# Altium schematic sheet Vesc_Simple_2.SchDoc
size C
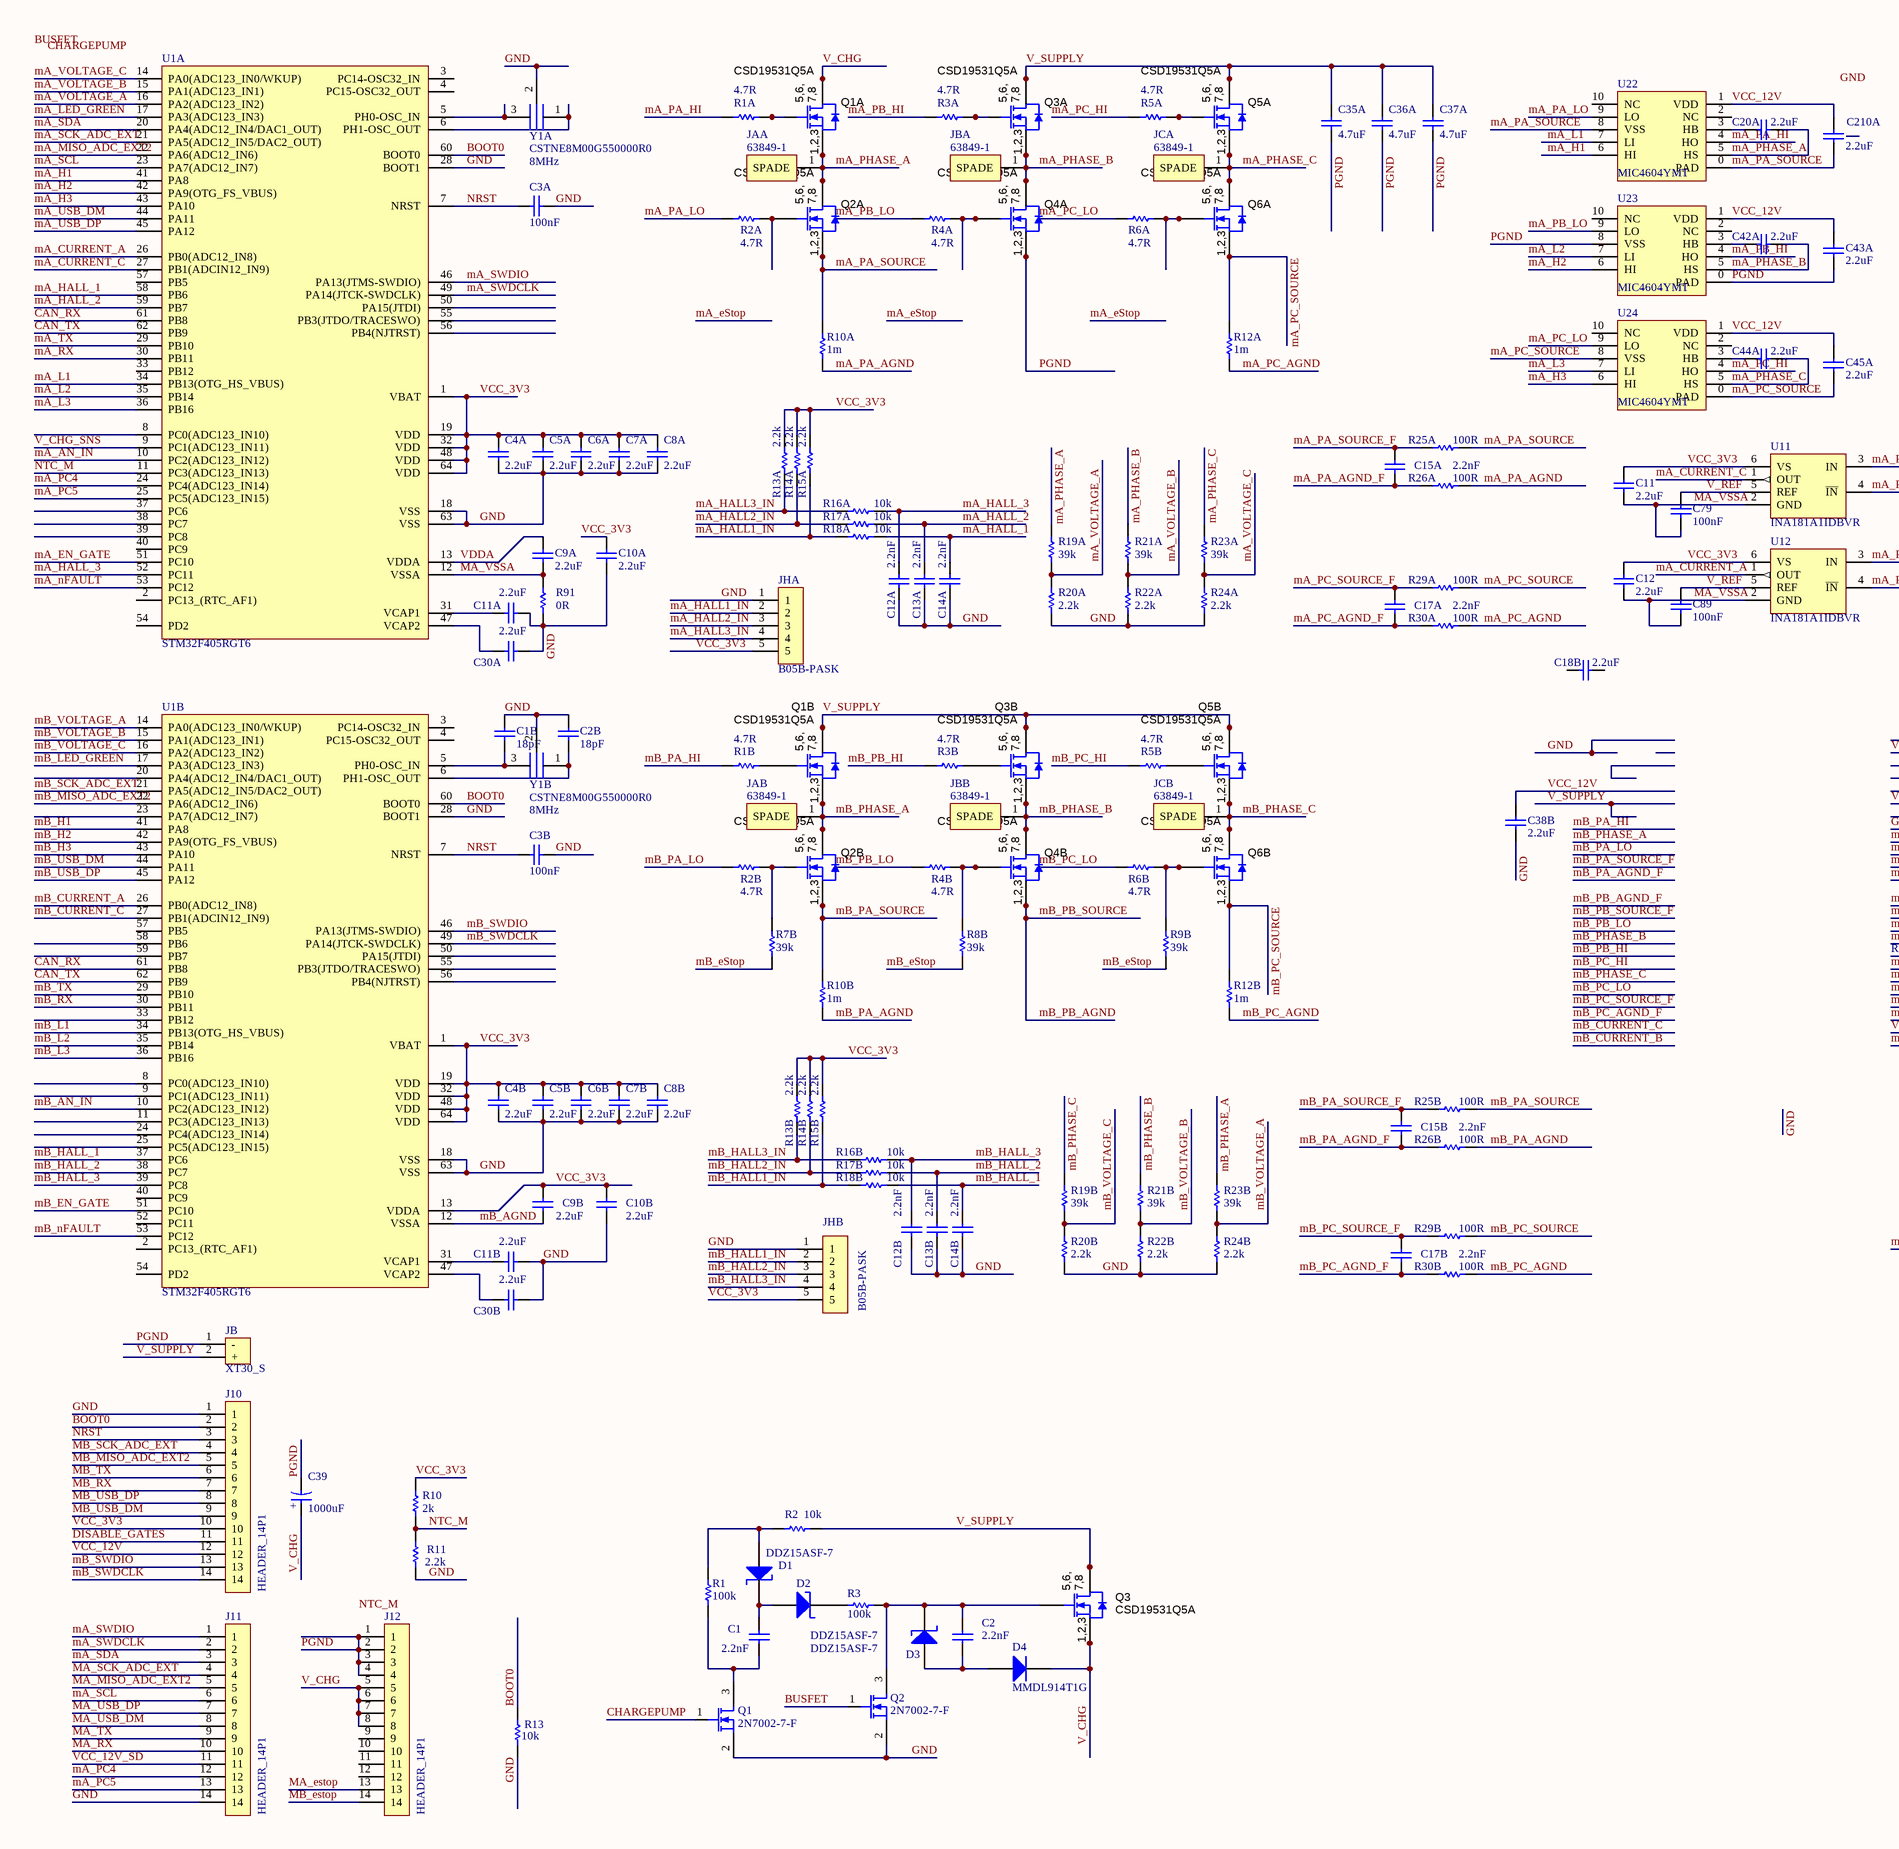
[diagram p0: Vesc_Simple_2.SchDoc, left]
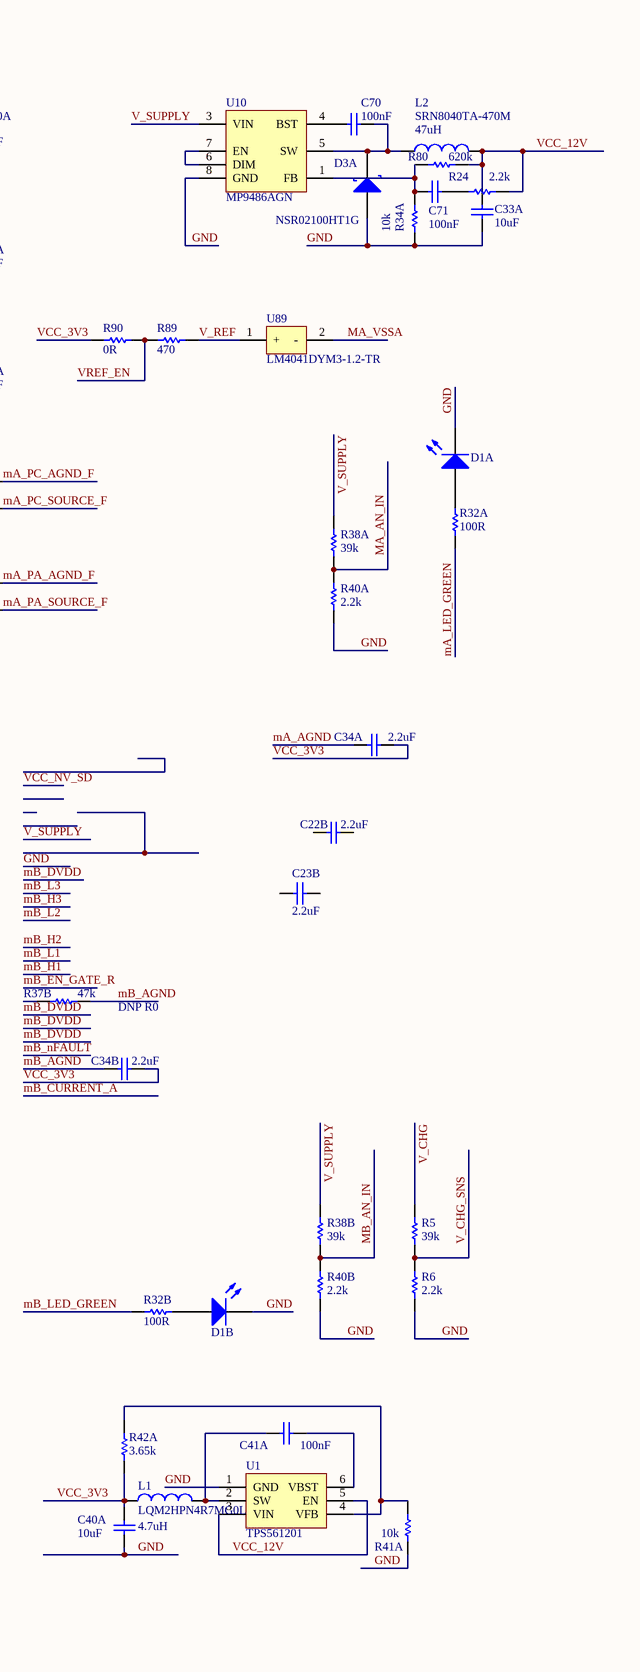
[diagram p1: Vesc_Simple_2.SchDoc, right]

## Parts
C1  value 2.2nF  [CAP 0402]  (hidden comment: GCM155R72A222KA37D)
C1B  value 18pF  [CAP 0402]  (hidden comment: GCM1555C1H180JA16D)
C2  value 2.2nF  [CAP 0402]  (hidden comment: GCM155R72A222KA37D)
C2B  value 18pF  [CAP 0402]  (hidden comment: GCM1555C1H180JA16D)
C3A  value 100nF  [CAP 0402]  (hidden comment: C0402C104K3RACTU)
C3B  value 100nF  [CAP 0402]  (hidden comment: C0402C104K3RACTU)
C4A  value 2.2uF  [CAP 0402]  (hidden comment: GRM155C81C225ME15D)
C4B  value 2.2uF  [CAP 0402]  (hidden comment: GRM155C81C225ME15D)
C5A  value 2.2uF  [CAP 0402]  (hidden comment: GRM155C81C225ME15D)
C5B  value 2.2uF  [CAP 0402]  (hidden comment: GRM155C81C225ME15D)
C6A  value 2.2uF  [CAP 0402]  (hidden comment: GRM155C81C225ME15D)
C6B  value 2.2uF  [CAP 0402]  (hidden comment: GRM155C81C225ME15D)
C7A  value 2.2uF  [CAP 0402]  (hidden comment: GRM155C81C225ME15D)
C7B  value 2.2uF  [CAP 0402]  (hidden comment: GRM155C81C225ME15D)
C8A  value 2.2uF  [CAP 0402]  (hidden comment: GRM155C81C225ME15D)
C8B  value 2.2uF  [CAP 0402]  (hidden comment: GRM155C81C225ME15D)
C9A  value 2.2uF  [CAP 0402]  (hidden comment: GRM155C81C225ME15D)
C9B  value 2.2uF  [CAP 0402]  (hidden comment: GRM155C81C225ME15D)
C10A  value 2.2uF  [CAP 0402]  (hidden comment: GRM155C81C225ME15D)
C10B  value 2.2uF  [CAP 0402]  (hidden comment: GRM155C81C225ME15D)
C11  value 2.2uF  [CAP 0402]  (hidden comment: GRM155C81C225ME15D)
C11A  value 2.2uF  [CAP 0402]  (hidden comment: GRM155C81C225ME15D)
C11B  value 2.2uF  [CAP 0402]  (hidden comment: GRM155C81C225ME15D)
C12  value 2.2uF  [CAP 0402]  (hidden comment: GRM155C81C225ME15D)
C12A  value 2.2nF  [CAP 0402]  (hidden comment: GCM155R72A222KA37D)
C12B  value 2.2nF  [CAP 0402]  (hidden comment: GCM155R72A222KA37D)
C13A  value 2.2nF  [CAP 0402]  (hidden comment: GCM155R72A222KA37D)
C13B  value 2.2nF  [CAP 0402]  (hidden comment: GCM155R72A222KA37D)
C14A  value 2.2nF  [CAP 0402]  (hidden comment: GCM155R72A222KA37D)
C14B  value 2.2nF  [CAP 0402]  (hidden comment: GCM155R72A222KA37D)
C15A  value 2.2nF  [CAP 0402]  (hidden comment: GCM155R72A222KA37D)
C15B  value 2.2nF  [CAP 0402]  (hidden comment: GCM155R72A222KA37D)
C17A  value 2.2nF  [CAP 0402]  (hidden comment: GCM155R72A222KA37D)
C17B  value 2.2nF  [CAP 0402]  (hidden comment: GCM155R72A222KA37D)
C18B  value 2.2uF  [CAP 0402]  (hidden comment: GRM155C81C225ME15D)
C20A  value 2.2uF  [CAP 0402]  (hidden comment: GRM155C81C225ME15D)
C22B  value 2.2uF  [CAP 0402]  (hidden comment: GRM155C81C225ME15D)
C23B  value 2.2uF  [CAP 0402]  (hidden comment: GRM155C81C225ME15D)
C30A  value 2.2uF  [CAP 0402]  (hidden comment: GRM155C81C225ME15D)
C30B  value 2.2uF  [CAP 0402]  (hidden comment: GRM155C81C225ME15D)
C33A  value 10uF  [CAP 1206]  (hidden comment: TMK316AB7106KL-T)
C34A  value 2.2uF  [CAP 0402]  (hidden comment: GRM155C81C225ME15D)
C34B  value 2.2uF  [CAP 0402]  (hidden comment: GRM155C81C225ME15D)
C35A  value 4.7uF  [CAP 1210]  (hidden comment: CGA6M3X7S2A475M200AB)
C36A  value 4.7uF  [CAP 1210]  (hidden comment: CGA6M3X7S2A475M200AB)
C37A  value 4.7uF  [CAP 1210]  (hidden comment: CGA6M3X7S2A475M200AB)
C38B  value 2.2uF  [CAP 0402]  (hidden comment: GRM155C81C225ME15D)
C39  value 1000uF  [CAP 7.5mm Bent]  (hidden comment: 108CKS100MRY)
C40A  value 10uF  [CAP 1206]  (hidden comment: TMK316AB7106KL-T)
C41A  value 100nF  [CAP 0402]  (hidden comment: C0402C104K3RACTU)
C42A  value 2.2uF  [CAP 0402]  (hidden comment: GRM155C81C225ME15D)
C43A  value 2.2uF  [CAP 0402]  (hidden comment: GRM155C81C225ME15D)
C44A  value 2.2uF  [CAP 0402]  (hidden comment: GRM155C81C225ME15D)
C45A  value 2.2uF  [CAP 0402]  (hidden comment: GRM155C81C225ME15D)
C70  value 100nF  [CAP 0402]  (hidden comment: C0402C104K3RACTU)
C71  value 100nF  [CAP 0402]  (hidden comment: C0402C104K3RACTU)
C79  value 100nF  [CAP 0402]  (hidden comment: C0402C104K3RACTU)
C89  value 100nF  [CAP 0402]  (hidden comment: C0402C104K3RACTU)
C210A  value 2.2uF  [CAP 0402]  (hidden comment: GRM155C81C225ME15D)
D1  DDZ15ASF-7  [SOD-323/SC76]
D1A  LTST-C190KRKT  [LED 0603]  (value not drawn)
D1B  LTST-C190KRKT  [LED 0603]  (value not drawn)
D2  DDZ15ASF-7  [SOD-323/SC76]
D3  DDZ15ASF-7  [SOD-323/SC76]
D3A  NSR02100HT1G  [SOD-323/SC76]
D4  MMDL914T1G  [SOD-323/SC76]
J10  HEADER_14P1  [HEADER_14P1_FEMALE_TH]
J11  HEADER_14P1  [HEADER_14P1_FEMALE_TH]
J12  HEADER_14P1  [HEADER_14P1_FEMALE_TH]
JAA  63849-1  [63849-1]
JAB  63849-1  [63849-1]
JB  XT30_S  [XT30 SOCKET]
JBA  63849-1  [63849-1]
JBB  63849-1  [63849-1]
JCA  63849-1  [63849-1]
JCB  63849-1  [63849-1]
JHA  B05B-PASK  [B05B-PASK]
JHB  B05B-PASK  [B05B-PASK]
L1  LQM2HPN4R7MG0L  value 4.7uH  [IND 1008]
L2  SRN8040TA-470M  value 47uH  [SRN8040TA]
Q1  2N7002-7-F  [SOT-23-3]
Q1A  CSD19531Q5A  [VSONP-8]
Q1B  CSD19531Q5A  [VSONP-8]
Q2  2N7002-7-F  [SOT-23-3]
Q2A  CSD19531Q5A  [VSONP-8]
Q2B  CSD19531Q5A  [VSONP-8]
Q3  CSD19531Q5A  [VSONP-8]
Q3A  CSD19531Q5A  [VSONP-8]
Q3B  CSD19531Q5A  [VSONP-8]
Q4A  CSD19531Q5A  [VSONP-8]
Q4B  CSD19531Q5A  [VSONP-8]
Q5A  CSD19531Q5A  [VSONP-8]
Q5B  CSD19531Q5A  [VSONP-8]
Q6A  CSD19531Q5A  [VSONP-8]
Q6B  CSD19531Q5A  [VSONP-8]
R1  value 100k  [RES 0402]  (hidden comment: ERJ-2RKF1003X)
R1A  value 4.7R  [RES 0402]  (hidden comment: ERJ-PA3J4R7V)
R1B  value 4.7R  [RES 0402]  (hidden comment: ERJ-PA3J4R7V)
R2  value 10k  [RES 0402]  (hidden comment: ERJ-2RKF1002X)
R2A  value 4.7R  [RES 0402]  (hidden comment: ERJ-PA3J4R7V)
R2B  value 4.7R  [RES 0402]  (hidden comment: ERJ-PA3J4R7V)
R3  value 100k  [RES 0402]  (hidden comment: ERJ-2RKF1003X)
R3A  value 4.7R  [RES 0402]  (hidden comment: ERJ-PA3J4R7V)
R3B  value 4.7R  [RES 0402]  (hidden comment: ERJ-PA3J4R7V)
R4A  value 4.7R  [RES 0402]  (hidden comment: ERJ-PA3J4R7V)
R4B  value 4.7R  [RES 0402]  (hidden comment: ERJ-PA3J4R7V)
R5  value 39k  [RES 0402]  (hidden comment: ERJ-2RKF3902X)
R5A  value 4.7R  [RES 0402]  (hidden comment: ERJ-PA3J4R7V)
R5B  value 4.7R  [RES 0402]  (hidden comment: ERJ-PA3J4R7V)
R6  value 2.2k  [RES 0402]  (hidden comment: ERJ-2RKF2201X)
R6A  value 4.7R  [RES 0402]  (hidden comment: ERJ-PA3J4R7V)
R6B  value 4.7R  [RES 0402]  (hidden comment: ERJ-PA3J4R7V)
R7B  value 39k  [RES 0402]  (hidden comment: ERJ-2RKF3902X)
R8B  value 39k  [RES 0402]  (hidden comment: ERJ-2RKF3902X)
R9B  value 39k  [RES 0402]  (hidden comment: ERJ-2RKF3902X)
R10  value 2k  [RES 0402]  (hidden comment: ERT-J0EG202GM)
R10A  value 1m  [WSL2726]  (hidden comment: WSL27262L000FEB)
R10B  value 1m  [WSL2726]  (hidden comment: WSL27262L000FEB)
R11  value 2.2k  [RES 0402]  (hidden comment: ERJ-2RKF2201X)
R12A  value 1m  [WSL2726]  (hidden comment: WSL27262L000FEB)
R12B  value 1m  [WSL2726]  (hidden comment: WSL27262L000FEB)
R13  value 10k  [RES 0402]  (hidden comment: ERJ-2RKF1002X)
R13A  value 2.2k  [RES 0402]  (hidden comment: ERJ-2RKF2201X)
R13B  value 2.2k  [RES 0402]  (hidden comment: ERJ-2RKF2201X)
R14A  value 2.2k  [RES 0402]  (hidden comment: ERJ-2RKF2201X)
R14B  value 2.2k  [RES 0402]  (hidden comment: ERJ-2RKF2201X)
R15A  value 2.2k  [RES 0402]  (hidden comment: ERJ-2RKF2201X)
R15B  value 2.2k  [RES 0402]  (hidden comment: ERJ-2RKF2201X)
R16A  value 10k  [RES 0402]  (hidden comment: ERJ-2RKF1002X)
R16B  value 10k  [RES 0402]  (hidden comment: ERJ-2RKF1002X)
R17A  value 10k  [RES 0402]  (hidden comment: ERJ-2RKF1002X)
R17B  value 10k  [RES 0402]  (hidden comment: ERJ-2RKF1002X)
R18A  value 10k  [RES 0402]  (hidden comment: ERJ-2RKF1002X)
R18B  value 10k  [RES 0402]  (hidden comment: ERJ-2RKF1002X)
R19A  value 39k  [RES 0402]  (hidden comment: ERJ-2RKF3902X)
R19B  value 39k  [RES 0402]  (hidden comment: ERJ-2RKF3902X)
R20A  value 2.2k  [RES 0402]  (hidden comment: ERJ-2RKF2201X)
R20B  value 2.2k  [RES 0402]  (hidden comment: ERJ-2RKF2201X)
R21A  value 39k  [RES 0402]  (hidden comment: ERJ-2RKF3902X)
R21B  value 39k  [RES 0402]  (hidden comment: ERJ-2RKF3902X)
R22A  value 2.2k  [RES 0402]  (hidden comment: ERJ-2RKF2201X)
R22B  value 2.2k  [RES 0402]  (hidden comment: ERJ-2RKF2201X)
R23A  value 39k  [RES 0402]  (hidden comment: ERJ-2RKF3902X)
R23B  value 39k  [RES 0402]  (hidden comment: ERJ-2RKF3902X)
R24  value 2.2k  [RES 0402]  (hidden comment: ERJ-2RKF2201X)
R24A  value 2.2k  [RES 0402]  (hidden comment: ERJ-2RKF2201X)
R24B  value 2.2k  [RES 0402]  (hidden comment: ERJ-2RKF2201X)
R25A  value 100R  [RES 0402]  (hidden comment: ERJ-2RKF1000X)
R25B  value 100R  [RES 0402]  (hidden comment: ERJ-2RKF1000X)
R26A  value 100R  [RES 0402]  (hidden comment: ERJ-2RKF1000X)
R26B  value 100R  [RES 0402]  (hidden comment: ERJ-2RKF1000X)
R29A  value 100R  [RES 0402]  (hidden comment: ERJ-2RKF1000X)
R29B  value 100R  [RES 0402]  (hidden comment: ERJ-2RKF1000X)
R30A  value 100R  [RES 0402]  (hidden comment: ERJ-2RKF1000X)
R30B  value 100R  [RES 0402]  (hidden comment: ERJ-2RKF1000X)
R32A  value 100R  [RES 0402]  (hidden comment: ERJ-2RKF1000X)
R32B  value 100R  [RES 0402]  (hidden comment: ERJ-2RKF1000X)
R34A  value 10k  [RES 0402]  (hidden comment: ERJ-2RKF1002X)
R37B  value 47k  [RES 0402]  (hidden comment: ERJ-2RKF4702X)
R38A  value 39k  [RES 0402]  (hidden comment: ERJ-2RKF3902X)
R38B  value 39k  [RES 0402]  (hidden comment: ERJ-2RKF3902X)
R40A  value 2.2k  [RES 0402]  (hidden comment: ERJ-2RKF2201X)
R40B  value 2.2k  [RES 0402]  (hidden comment: ERJ-2RKF2201X)
R41A  value 10k  [RES 0402]  (hidden comment: ERJ-2RKF1002X)
R42A  value 3.65k  [RES 0402]  (hidden comment: ERJ-2RKF3651X)
R80  value 620k  [RES 0402]  (hidden comment: ERJ-2RKF6203X)
R89  value 470  [RES 0402]  (hidden comment: ERJ-2RKF4700X)
R90  value 0R  [RES 0402]  (hidden comment: ERJ-2GE0R00X)
R91  value 0R  [RES 0402]  (hidden comment: ERJ-2GE0R00X)
U1  TPS561201  [SOT-23-6]
U1A  STM32F405RGT6  [QFP-64 - P0.5MM]
U1B  STM32F405RGT6  [QFP-64 - P0.5MM]
U10  MP9486AGN  [SOIC-8]
U11  INA181A1IDBVR  [SOT-23-6]
U12  INA181A1IDBVR  [SOT-23-6]
U22  MIC4604YMT  [TDFN-10]
U23  MIC4604YMT  [TDFN-10]
U24  MIC4604YMT  [TDFN-10]
U89  LM4041DYM3-1.2-TR  [SOT-23-3]
Y1A  CSTNE8M00G550000R0  value 8MHz  [MuRata CSTN]
Y1B  CSTNE8M00G550000R0  value 8MHz  [MuRata CSTN]

## Nets
BOOT0: J10.2 R13.2 U1A.60(BOOT0) U1B.60(BOOT0)
BUSFET: Q2.1(G)
CAN_RX: U1A.61(PB8) U1B.61(PB8)
CAN_TX: U1A.62(PB9) U1B.62(PB9)
CHARGEPUMP: Q1.1(G)
DISABLE_GATES: J10.11
GND: C1B.2 C2B.2 C3A.2 C3B.2 C4A.2 C4B.2 C5A.2 C5B.2 C6A.2 C6B.2 C7A.2 C7B.2 C8A.2 C8B.2 C10A.2 C10B.2 C11A.2 C11B.2 C12A.1 C12B.1 C13A.1 C13B.1 C14A.1 C14B.1 C30A.2 C30B.2 C33A.2 C38B.2 C40A.2 D1A.2(K) D1B.2(K) D3A.1(A) J10.1 J11.14 JHA.1 JHB.1 Q1.2(S) Q2.2(S) R6.1 R11.1 R13.1 R20A.1 R20B.1 R22A.1 R22B.1 R24A.1 R24B.1 R34A.1 R40A.1 R40B.1 R41A.1 R91.1 U1.1(GND) U1A.18(VSS) U1A.28(BOOT1) U1A.63(VSS) U1B.18(VSS) U1B.28(BOOT1) U1B.63(VSS) U10.8(GND) Y1A.2 Y1B.2
mA_AGND: C34A.2
mA_AN_IN: R38A.1 R40A.2 U1A.10(PC2(ADC123_IN12))
mA_CURRENT_A: U1A.26(PB0(ADC12_IN8)) U12.1(OUT)
mA_CURRENT_C: U1A.27(PB1(ADCIN12_IN9)) U11.1(OUT)
mA_EN_GATE: U1A.51(PC10)
mA_eStop: J12.13
mA_H1: U1A.41(PA8) U22.6(HI)
mA_H2: U1A.42(PA9(OTG_FS_VBUS)) U23.6(HI)
mA_H3: U1A.43(PA10) U24.6(HI)
mA_HALL1_IN: JHA.2 R15A.1 R18A.1
mA_HALL2_IN: JHA.3 R14A.1 R17A.1
mA_HALL3_IN: JHA.4 R13A.1 R16A.1
mA_HALL_1: C14A.2 R18A.2 U1A.58(PB6)
mA_HALL_2: C13A.2 R17A.2 U1A.59(PB7)
mA_HALL_3: C12A.2 R16A.2 U1A.52(PC11)
mA_L1: U1A.34(PB13(OTG_HS_VBUS)) U22.7(LI)
mA_L2: U1A.35(PB14) U23.7(LI)
mA_L3: U1A.36(PB16) U24.7(LI)
mA_LED_GREEN: R32A.2 U1A.17(PA3(ADC123_IN3))
mA_MISO_ADC_EXT2: J11.5 U1A.22(PA6(ADC12_IN6))
mA_nFAULT: U1A.53(PC12)
mA_PA_AGND: R10A.1 R26A.2
mA_PA_AGND_F: C15A.1 R26A.1 U12.3(IN)
mA_PA_HI: R1A.1 U22.4(HO)
mA_PA_LO: R2A.1 U22.9(LO)
mA_PA_SOURCE: C210A.2 Q2A.1(S) Q2A.2(S) Q2A.3(S) R10A.2 R25A.2 U22.0(PAD) U22.8(VSS)
mA_PA_SOURCE_F: C15A.2 R25A.1 U12.4(~{IN})
mA_PB_HI: R3A.1 U23.4(HO)
mA_PB_LO: R4A.1 U23.9(LO)
mA_PC4: J11.12 U1A.24(PC4(ADC123_IN14))
mA_PC5: J11.13 U1A.25(PC5(ADC123_IN15))
mA_PC_AGND: R12A.2 R30A.2
mA_PC_AGND_F: C17A.1 R30A.1 U11.3(IN)
mA_PC_HI: R5A.1 U24.4(HO)
mA_PC_LO: R6A.1 U24.9(LO)
mA_PC_SOURCE: C45A.2 Q6A.1(S) Q6A.2(S) Q6A.3(S) R12A.1 R29A.2 U24.0(PAD) U24.8(VSS)
mA_PC_SOURCE_F: C17A.2 R29A.1 U11.4(~{IN})
mA_PHASE_A: C20A.1 JAA.1(SPADE) Q1A.1(S) Q1A.2(S) Q1A.3(S) Q2A.5(D) Q2A.6(D) Q2A.7(D) Q2A.8(D) Q2A.9(D) R19A.2 U22.5(HS)
mA_PHASE_B: C42A.1 JBA.1(SPADE) Q3A.1(S) Q3A.2(S) Q3A.3(S) Q4A.5(D) Q4A.6(D) Q4A.7(D) Q4A.8(D) Q4A.9(D) R21A.2 U23.5(HS)
mA_PHASE_C: C44A.1 JCA.1(SPADE) Q5A.1(S) Q5A.2(S) Q5A.3(S) Q6A.5(D) Q6A.6(D) Q6A.7(D) Q6A.8(D) Q6A.9(D) R23A.2 U24.5(HS)
mA_RX: J11.10 U1A.30(PB11)
mA_SCK_ADC_EXT: J11.4 U1A.21(PA5(ADC12_IN5/DAC2_OUT))
mA_SCL: J11.6 U1A.23(PA7(ADC12_IN7))
mA_SDA: J11.3 U1A.20(PA4(ADC12_IN4/DAC1_OUT))
mA_SWDCLK: J11.2 U1A.49(PA14(JTCK-SWDCLK))
mA_SWDIO: J11.1 U1A.46(PA13(JTMS-SWDIO))
mA_TX: J11.9 U1A.29(PB10)
mA_USB_DM: J11.8 U1A.44(PA11)
mA_USB_DP: J11.7 U1A.45(PA12)
mA_VOLTAGE_A: R19A.1 R20A.2 U1A.16(PA2(ADC123_IN2))
mA_VOLTAGE_B: R21A.1 R22A.2 U1A.15(PA1(ADC123_IN1))
mA_VOLTAGE_C: R23A.1 R24A.2 U1A.14(PA0(ADC123_IN0/WKUP))
MA_VSSA: C9A.2 C11.2 C12.2 C79.1 C89.1 R91.2 U1A.12(VSSA) U11.2(GND) U12.2(GND) U89.2(-)
mB_AGND: C9B.2 C34B.2 R37B.2 U1B.12(VSSA)
mB_AN_IN: R38B.1 R40B.2 U1B.10(PC2(ADC123_IN12))
mB_CURRENT_A: U1B.26(PB0(ADC12_IN8))
mB_CURRENT_C: U1B.27(PB1(ADCIN12_IN9))
mB_EN_GATE: U1B.51(PC10)
mB_eStop: J12.14 R7B.1 R8B.1 R9B.1
mB_H1: U1B.41(PA8)
mB_H2: U1B.42(PA9(OTG_FS_VBUS))
mB_H3: U1B.43(PA10)
mB_HALL1_IN: JHB.2 R15B.1 R18B.1
mB_HALL2_IN: JHB.3 R14B.1 R17B.1
mB_HALL3_IN: JHB.4 R13B.1 R16B.1
mB_HALL_1: C14B.2 R18B.2 U1B.37(PC6)
mB_HALL_2: C13B.2 R17B.2 U1B.38(PC7)
mB_HALL_3: C12B.2 R16B.2 U1B.39(PC8)
mB_L1: U1B.34(PB13(OTG_HS_VBUS))
mB_L2: U1B.35(PB14)
mB_L3: U1B.36(PB16)
mB_LED_GREEN: R32B.2 U1B.17(PA3(ADC123_IN3))
mB_MISO_ADC_EXT2: J10.5 U1B.22(PA6(ADC12_IN6))
mB_nFAULT: U1B.53(PC12)
mB_PA_AGND: R10B.1 R26B.2
mB_PA_AGND_F: C15B.1 R26B.1
mB_PA_HI: R1B.1
mB_PA_LO: R2B.1
mB_PA_SOURCE: Q2B.1(S) Q2B.2(S) Q2B.3(S) R10B.2 R25B.2
mB_PA_SOURCE_F: C15B.2 R25B.1
mB_PB_AGND: Q4B.1(S) Q4B.2(S) Q4B.3(S)  [also labelled mB_PB_SOURCE]
mB_PB_HI: R3B.1
mB_PB_LO: R4B.1
mB_PC_AGND: R12B.2 R30B.2
mB_PC_AGND_F: C17B.1 R30B.1
mB_PC_HI: R5B.1
mB_PC_LO: R6B.1
mB_PC_SOURCE: Q6B.1(S) Q6B.2(S) Q6B.3(S) R12B.1 R29B.2
mB_PC_SOURCE_F: C17B.2 R29B.1
mB_PHASE_A: JAB.1(SPADE) Q1B.1(S) Q1B.2(S) Q1B.3(S) Q2B.5(D) Q2B.6(D) Q2B.7(D) Q2B.8(D) Q2B.9(D) R23B.2
mB_PHASE_B: JBB.1(SPADE) Q3B.1(S) Q3B.2(S) Q3B.3(S) Q4B.5(D) Q4B.6(D) Q4B.7(D) Q4B.8(D) Q4B.9(D) R21B.2
mB_PHASE_C: JCB.1(SPADE) Q5B.1(S) Q5B.2(S) Q5B.3(S) Q6B.5(D) Q6B.6(D) Q6B.7(D) Q6B.8(D) Q6B.9(D) R19B.2
mB_RX: J10.7 U1B.30(PB11)
mB_SCK_ADC_EXT: J10.4 U1B.21(PA5(ADC12_IN5/DAC2_OUT))
mB_SWDCLK: J10.14 U1B.49(PA14(JTCK-SWDCLK))
mB_SWDIO: J10.13 U1B.46(PA13(JTMS-SWDIO))
mB_TX: J10.6 U1B.29(PB10)
mB_USB_DM: J10.9 U1B.44(PA11)
mB_USB_DP: J10.8 U1B.45(PA12)
mB_VOLTAGE_A: R23B.1 R24B.2 U1B.14(PA0(ADC123_IN0/WKUP))
mB_VOLTAGE_B: R21B.1 R22B.2 U1B.15(PA1(ADC123_IN1))
mB_VOLTAGE_C: R19B.1 R20B.2 U1B.16(PA2(ADC123_IN2))
NRST: C3A.1 C3B.1 J10.3 U1A.7(NRST) U1B.7(NRST)
NTC_M: R10.1 R11.2 U1A.11(PC3(ADC123_IN13))
PGND: C35A.1 C36A.1 C37A.1 C39.1 C43A.2 J12.1 J12.2 J12.3 J12.4 JB.1(-) Q4A.1(S) Q4A.2(S) Q4A.3(S) U23.0(PAD) U23.8(VSS)
V_CHG: C39.2 D4.2(K) J12.5 J12.6 J12.7 J12.8 Q1A.5(D) Q1A.6(D) Q1A.7(D) Q1A.8(D) Q1A.9(D) Q3.1(S) Q3.2(S) Q3.3(S) R5.2
V_CHG_SNS: R5.1 R6.2 U1A.9(PC1(ADC123_IN11))
V_REF: C79.2 C89.2 R89.2 U11.5(REF) U12.5(REF) U89.1(+)
V_SUPPLY: C35A.2 C36A.2 C37A.2 JB.2(+) Q1B.5(D) Q1B.6(D) Q1B.7(D) Q1B.8(D) Q1B.9(D) Q3.5(D) Q3.6(D) Q3.7(D) Q3.8(D) Q3.9(D) Q3A.5(D) Q3A.6(D) Q3A.7(D) Q3A.8(D) Q3A.9(D) Q3B.5(D) Q3B.6(D) Q3B.7(D) Q3B.8(D) Q3B.9(D) Q5A.5(D) Q5A.6(D) Q5A.7(D) Q5A.8(D) Q5A.9(D) Q5B.5(D) Q5B.6(D) Q5B.7(D) Q5B.8(D) Q5B.9(D) R2.2 R38A.2 R38B.2 U10.3(VIN)
VCC_3V3: C4A.1 C4B.1 C5A.1 C5B.1 C6A.1 C6B.1 C7A.1 C7B.1 C8A.1 C8B.1 C9B.1 C10A.1 C10B.1 C11.1 C12.1 C34A.1 C34B.1 C40A.1 J10.10 JHA.5 JHB.5 L1.1 R10.2 R13A.2 R13B.2 R14A.2 R14B.2 R15A.2 R15B.2 R42A.1 R90.1 U1A.1(VBAT) U1A.19(VDD) U1A.32(VDD) U1A.48(VDD) U1A.64(VDD) U1B.1(VBAT) U1B.13(VDDA) U1B.19(VDD) U1B.32(VDD) U1B.48(VDD) U1B.64(VDD) U11.6(VS) U12.6(VS)
VCC_12V: C33A.1 C38B.1 C43A.1 C45A.1 C210A.1 J10.12 L2.2 R24.1 R80.2 U1.3(VIN) U1.5(EN) U22.1(VDD) U23.1(VDD) U24.1(VDD)
VCC_12V_SD: J11.11
VDDA: C9A.1 U1A.13(VDDA)
VREF_EN: R89.1 R90.2
NetC1_1: C1.1 Q1.3(D) R1.1
NetC1_2: C1.2 D1.2(K) D2.1(A2)
NetC1B_1: C1B.1 U1B.5(PH0-OSC_IN) Y1B.3
NetC2_1: C2.1 D3.1(A2) D4.1(A)
NetC2_2: C2.2 D3.2(K) Q2.3(D) Q3.4(G) R3.2
NetC2B_1: C2B.1 U1B.6(PH1-OSC_OUT) Y1B.1
NetC11A_1: C11A.1 U1A.31(VCAP1)
NetC11B_1: C11B.1 U1B.31(VCAP1)
NetC20A_2: C20A.2 U22.3(HB)
NetC30A_1: C30A.1 U1A.47(VCAP2)
NetC30B_1: C30B.1 U1B.47(VCAP2)
NetC41A_1: C41A.1 L1.2 U1.2(SW)
NetC41A_2: C41A.2 U1.6(VBST)
NetC42A_2: C42A.2 U23.3(HB)
NetC44A_2: C44A.2 U24.3(HB)
NetC70_1: C70.1 D3A.2(K) L2.1 U10.5(SW)
NetC70_2: C70.2 U10.4(BST)
NetC71_1: C71.1 R34A.2 R80.1 U10.1(FB)
NetC71_2: C71.2 R24.2
NetD1_1: D1.1(A2) R1.2 R2.1
NetD1A_1: D1A.1(A) R32A.1
NetD1B_1: D1B.1(A) R32B.1
NetD2_2: D2.2(K) R3.1
NetQ1A_4: Q1A.4(G) R1A.2
NetQ1B_4: Q1B.4(G) R1B.2
NetQ2A_4: Q2A.4(G) R2A.2
NetQ2B_4: Q2B.4(G) R2B.2 R7B.2
NetQ3A_4: Q3A.4(G) R3A.2
NetQ3B_4: Q3B.4(G) R3B.2
NetQ4A_4: Q4A.4(G) R4A.2
NetQ4B_4: Q4B.4(G) R4B.2 R8B.2
NetQ5A_4: Q5A.4(G) R5A.2
NetQ5B_4: Q5B.4(G) R5B.2
NetQ6A_4: Q6A.4(G) R6A.2
NetQ6B_4: Q6B.4(G) R6B.2 R9B.2
NetR41A_2: R41A.2 R42A.2 U1.4(VFB)
NetU1A_5: U1A.5(PH0-OSC_IN) Y1A.3
NetU1A_6: U1A.6(PH1-OSC_OUT) Y1A.1
NetU10_6: U10.6(DIM) U10.7(EN)

Not connected (* = marked no-connect by the designer): C18B 1 2; C22B 1 2; C23B 1 2; J12 9 10 11 12; R37B 1; U1A 2(PC13_(RTC_AF1)) 3(PC14-OSC32_IN) 4(PC15-OSC32_OUT) 8(PC0(ADC123_IN10)) 33(PB12) 37(PC6) 38(PC7) 39(PC8) 40(PC9) 50(PA15(JTDI)) 54(PD2) 55(PB3(JTDO/TRACESWO)) 56(PB4(NJTRST)) 57(PB5); U1B 2(PC13_(RTC_AF1)) 3(PC14-OSC32_IN) 4(PC15-OSC32_OUT) 8(PC0(ADC123_IN10)) 9(PC1(ADC123_IN11)) 11(PC3(ADC123_IN13)) 20(PA4(ADC12_IN4/DAC1_OUT)) 23(PA7(ADC12_IN7)) 24(PC4(ADC123_IN14)) 25(PC5(ADC123_IN15)) 33(PB12) 40(PC9) 50(PA15(JTDI)) 52(PC11) 54(PD2) 55(PB3(JTDO/TRACESWO)) 56(PB4(NJTRST)) 57(PB5) 58(PB6) 59(PB7); U22 2(NC) 10(NC); U23 2(NC) 10(NC); U24 2(NC) 10(NC)

## Notes on the sheet
- DNP R0
- Labels drawn without touching a wire or pin: BUSFET, CHARGEPUMP, GND, NTC_M
- (in symbol 108CKS100MRY) +
- (in symbol CSD19531Q5A) 5,6,; 7,8; 1,2,3

## Library data of the parts
C1 C2 C12A C12B C13A C13B C14A C14B C15A C15B C17A C17B = GCM155R72A222KA37D: CAP 0402 2.2nF 100V (X7R DIELECTRIC); WVDC: 100
C1B C2B = GCM1555C1H180JA16D: CAP 0402 18pF 50V (NP0 Dielectric); WVDC: 50
C3A C3B C41A C70 C71 C79 C89 = C0402C104K3RACTU: CAP 0402 100nF 10V; WVDC: 25
C4A C4B C5A C5B C6A C6B C7A C7B C8A C8B C9A C9B C10A C10B C11 C11A C11B C12 C18B C20A C22B C23B C30A C30B C34A C34B C38B C42A C43A C44A C45A C210A = GRM155C81C225ME15D: CAP 0402 2.2uF 16V; WVDC: 16
C33A C40A = TMK316AB7106KL-T: CAP 1206 10uF 25V; WVDC: 25
C35A C36A C37A = CGA6M3X7S2A475M200AB: CAP 1206 4.7uF 100V; WVDC: 100
C39 = 108CKS100MRY: CAP 7.5mm Radial 1000uF 100V; WVDC: 100
D1-D3 = DDZ15ASF-7: Zener Diodes 500mW 13.785V Zener .9V Vf; Vrrm: 13.7; If: 200mA
D1A D1B = LTST-C190KRKT: RED LED
D3A = NSR02100HT1G: Schottky Diodes & Rectifiers 100V; Vrrm: 100; If: 200mA
D4 = MMDL914T1G: General Purpose Diodes & Rectifiers 100V; Vrrm: 100; If: 200mA
J10-J12 = HEADER_14P1: 2.54mm Header 14 Pin 1 Row
JAA JAB JBA JBB JCA JCB = 63849-1: SPADE CONNECTOR BOARD MOUNT
JB = XT30_S: XT30 SOCKET
L1 = LQM2HPN4R7MG0L: Fixed Inductors 1008 4.7uH 20% 1.1A
L2 = SRN8040TA-470M: Fixed Inductors 47uH 20% 1.7A non-shdSMD AEC-Q200; Isat: 2A
Q1 Q2 = 2N7002-7-F: MOSFET 60V 200mW
Q1A Q1B Q2A Q2B Q3 Q3A Q3B Q4A Q4B Q5A Q5B Q6A Q6B = CSD19531Q5A: 100V 100A VSONP-8 5.3mOhm Pwr MOSFET; Manufacturer: Texas Instruments; Value2: 48 nC; QgTyp_nC: 48; SizeAreaWB_mm2: 56; SizeArea_mm2: 30; SizeX_mm: 6; SizeY_mm: 5; SizeZ_mm: 1; PartNumber: CSD19531Q5A; Value: 100V; VdsMax_V: 100V; Vgs_V: 100V; IdsMax_A: 100A; RoHS: Y; ComponentLink1Description: Datasheet link
R1 R3 = ERJ-2RKF1003X: RES 0402 100k 1%
R1A R1B R2A R2B R3A R3B R4A R4B R5A R5B R6A R6B = ERJ-PA3J4R7V: RES 0402 4.7R 5%
R2 R13 R16A R16B R17A R17B R18A R18B R34A R41A = ERJ-2RKF1002X: RES 0402 10k 1%
R5 R7B R8B R9B R19A R19B R21A R21B R23A R23B R38A R38B = ERJ-2RKF3902X: RES 0402 39k 1%
R6 R11 R13A R13B R14A R14B R15A R15B R20A R20B R22A R22B R24 R24A R24B R40A R40B = ERJ-2RKF2201X: RES 0402 2.2k 1%
R10 = ERT-J0EG202GM: NTC THERMISTOR 0402 2k 2%
R10A R10B R12A R12B = WSL27262L000FEB: RES 2726 1mOhm 1%
R25A R25B R26A R26B R29A R29B R30A R30B R32A R32B = ERJ-2RKF1000X: RES 0402 100R 1%
R37B = ERJ-2RKF4702X: RES 0402 47k 1%
R42A = ERJ-2RKF3651X: RES 0402 3.65k 1%
R80 = ERJ-2RKF6203X: RES 0402 620K 1%
R89 = ERJ-2RKF4700X: RES 0402 470 1%
R90 R91 = ERJ-2GE0R00X: RES 0402 0R
U1 = TPS561201: 4.5V to 17V Input, 1A Synchronous Step-Down Voltage Regulator in 6-pin SOT-23
U1A U1B = STM32F405RGT6: Cortex M4 MCU
U10 = MP9486AGN: Switching Voltage Regulators 100V Input
U11 U12 = INA181A1IDBVR: Current Sense Amplifiers 20V/V
U22-U24 = MIC4604YMT: 85V Half Bridge Driver
U89 = LM4041DYM3-1.2-TR: Voltage References Fixed 1.225V
Y1A Y1B = CSTNE8M00G550000R0: Ceramic Resonator 8.0000MHz 33pf 0.5%